# EAGLE design schematic (EAGLE 8.1.0)
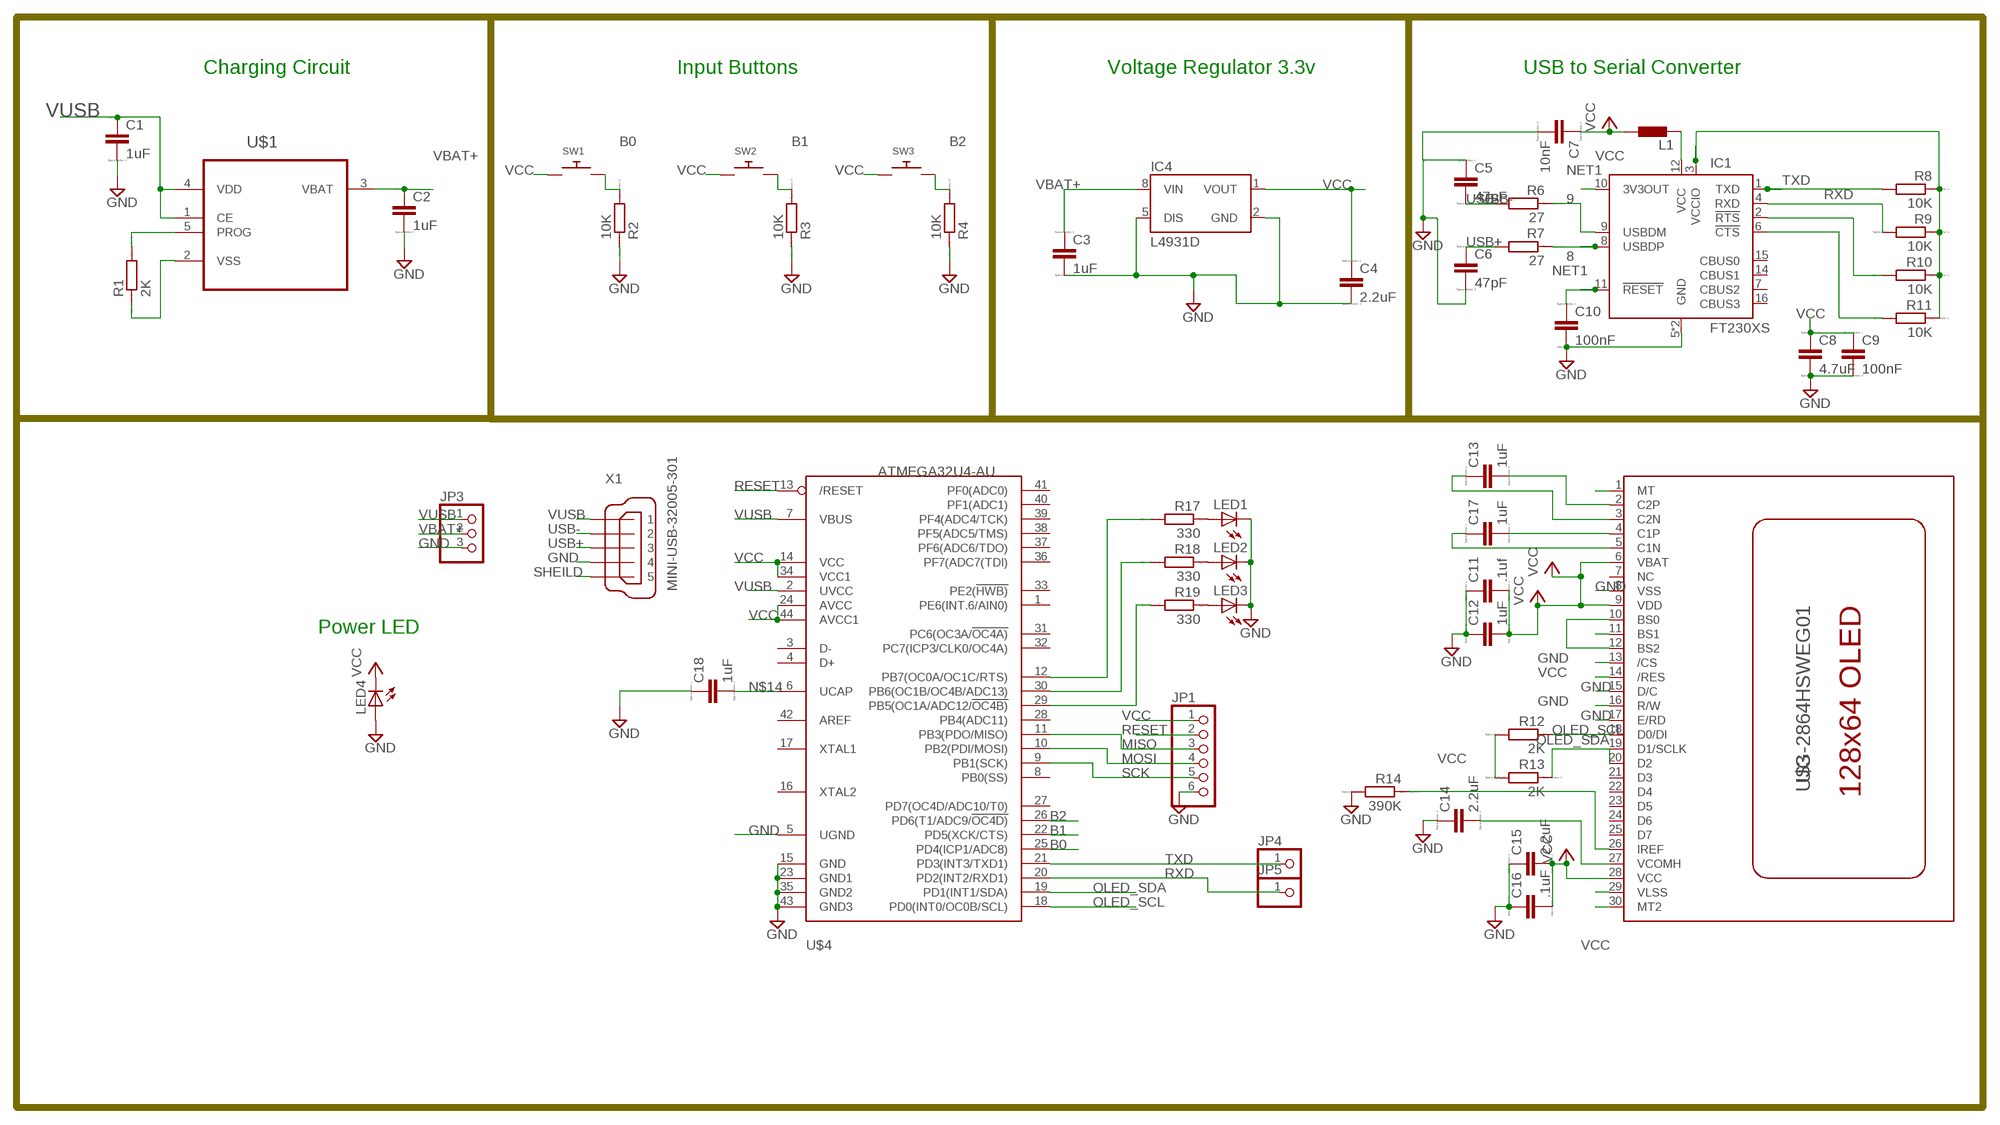
[diagram p0: schematic, sheet 1]

## Parts
C1  1uF  CC0504  [C0504]
C2  1uF  CC0504  [C0504]
C3  1uF  CC0504  [C0504]
C4  2.2uF  CC0504  [C0504]
C5  47pF  CC0504  [C0504]
C6  47pF  CC0504  [C0504]
C7  10nF  CC0504  [C0504]
C8  4.7uF  CC0504  [C0504]
C9  100nF  CC0504  [C0504]
C10  100nF  CC0504  [C0504]
C11  .1uf  CC0504  [C0504]
C12  1uF  CC0504  [C0504]
C13  1uF  CC0504  [C0504]
C14  2.2uF  CC0504  [C0504]
C15  2.2uF  CC0504  [C0504]
C16  .1uF  CC0504  [C0504]
C17  1uF  CC0504  [C0504]
C18  1uF  CC0504  [C0504]
IC1  FT230XS  [SSOP16]
IC4  L4931D  [SO08]
JP1  PINHD-1X6B  [1X06-BIG]
JP3  PINHD-1X3  [1X03]
JP4  PINHD-1X1  [1X01]
JP5  PINHD-1X1  [1X01]
L1  BLM15HB221SN1  [0402]
LED1  LEDSMT1206  [1206]
LED2  LEDSMT1206  [1206]
LED3  LEDSMT1206  [1206]
LED4  LEDSMT1206  [1206]
R1  2K  RR0603  [R0603]
R2  10K  RR0603  [R0603]
R3  10K  RR0603  [R0603]
R4  10K  RR0603  [R0603]
R6  27  RR0603  [R0603]
R7  27  RR0603  [R0603]
R8  10K  RR0603  [R0603]
R9  10K  RR0603  [R0603]
R10  10K  RR0603  [R0603]
R11  10K  RR0603  [R0603]
R12  2K  RR0603  [R0603]
R13  2K  RR0603  [R0603]
R14  390K  RR0603  [R0603]
R17  330  RR0603  [R0603]
R18  330  RR0603  [R0603]
R19  330  RR0603  [R0603]
SW1  SWITCH_PUSHBUTTONSOFTTOUCHSMD_SJ  [PUSHBUTTON_SMD_SJ]
SW2  SWITCH_PUSHBUTTONSOFTTOUCHSMD_SJ  [PUSHBUTTON_SMD_SJ]
SW3  SWITCH_PUSHBUTTONSOFTTOUCHSMD_SJ  [PUSHBUTTON_SMD_SJ]
U$1  MCP73812T-420I/OT  [SOT95P270X145-5N]
U$3  UG-2864HSWEG01  [1X30-0.7MM]
U$4  ATMEGA32U4-AU  [TQFP44]
X1  MINI-USB-32005-301  [32005-301]

## Nets
8: IC1.8(USBDP) R7.1
9: IC1.9(USBDM) R6.1
B0: R2.2 SW1.P$2 U$4.25(PD4(ICP1/ADC8))
B1: R3.2 SW2.P$2 U$4.22(PD5(XCK/CTS))
B2: R4.2 SW3.P$2 U$4.26(PD6(T1/ADC9/!OC4D))
FTDI_VCC: IC1.12(VCC) L1.1
GND: C1.2 C2.2 C3.2 C4.2 C5.1 C6.2 C7.2 C8.2 C9.2 C10.2 C11.1 C12.1 C14.1 C15.1 C16.1 C18.1 IC1.5(GND) IC1.13(GND) IC4.2(GND) IC4.5(DIS) JP1.6 JP3.3 LED1.C LED2.C LED3.C LED4.A R2.1 R3.1 R4.1 R14.2 U$3.1(MT) U$3.8(VSS) U$3.10(BS0) U$3.12(BS2) U$3.13(/CS) U$3.15(D/C) U$3.16(R/W) U$3.17(E/RD) U$3.29(VLSS) U$3.30(MT2) U$4.5(UGND) U$4.15(GND) U$4.23(GND1) U$4.35(GND2) U$4.43(GND3) X1.4
MISO: JP1.3 U$4.11(PB3(PDO/MISO))
MOSI: JP1.4 U$4.10(PB2(PDI/MOSI))
N$1: R1.2 U$1.5(PROG)
N$2: R1.1 U$1.2(VSS)
N$5: C14.2 U$3.27(VCOMH)
N$6: IC1.2(!RTS) R10.2
N$7: C13.2 U$3.2(C2P)
N$8: IC1.6(!CTS) R11.2
N$9: R14.1 U$3.26(IREF)
N$10: C13.1 U$3.3(C2N)
N$11: C17.2 U$3.4(C1P)
N$12: C17.1 U$3.5(C1N)
N$14: C18.2 U$4.6(UCAP)
N$17: LED1.A R17.1
N$18: LED2.A R18.1
N$19: LED3.A R19.1
N$21: R19.2 U$4.29(PB5(OC1A/ADC12/!OC4B))
N$22: R18.2 U$4.30(PB6(OC1B/OC4B/ADC13))
N$23: R17.2 U$4.12(PB7(OC0A/OC1C/RTS))
NET1: C10.1 IC1.3(VCCIO) IC1.10(3V3OUT) IC1.11(!RESET) R8.1 R9.1 R10.1 R11.1
OLED_SCL: R12.1 U$3.18(D0/DI) U$4.18(PD0(INT0/OC0B/SCL))
OLED_SDA: R13.1 U$3.19(D1/SCLK) U$3.20(D2) U$4.19(PD1(INT1/SDA))
RESET: JP1.2 U$4.13(/RESET)
RXD: IC1.4(RXD) JP5.1 R9.2 U$4.20(PD2(INT2/RXD1))
SCK: JP1.5 U$4.9(PB1(SCK))
SHEILD: X1.5
TXD: IC1.1(TXD) JP4.1 R8.2 U$4.21(PD3(INT3/TXD1))
USB+: C6.1 R7.2 X1.3
USB-: C5.2 R6.2 X1.2
VBAT+: C2.1 C3.1 IC4.8(VIN) JP3.2 U$1.3(VBAT)
VCC: C4.1 C7.1 C8.1 C9.1 C11.2 C12.2 C15.2 C16.2 IC4.1(VOUT) JP1.1 L1.2 LED4.C R12.2 R13.2 SW1.P$1 SW2.P$1 SW3.P$1 U$3.6(VBAT) U$3.9(VDD) U$3.11(BS1) U$3.14(/RES) U$3.28(VCC) U$4.14(VCC) U$4.24(AVCC) U$4.34(VCC1) U$4.44(AVCC1)
VUSB: C1.1 JP3.1 U$1.1(CE) U$1.4(VDD) U$4.2(UVCC) U$4.7(VBUS) X1.1
Unconnected: IC1.7(CBUS2) IC1.14(CBUS1) IC1.15(CBUS0) IC1.16(CBUS3) U$3.7(NC) U$3.21(D3) U$3.22(D4) U$3.23(D5) U$3.24(D6) U$3.25(D7) U$4.1(PE6(INT.6/AIN0)) U$4.3(D-) U$4.4(D+) U$4.8(PB0(SS)) U$4.16(XTAL2) U$4.17(XTAL1) U$4.27(PD7(OC4D/ADC10/T0)) U$4.28(PB4(ADC11)) U$4.31(PC6(OC3A/!OC4A)) U$4.32(PC7(ICP3/CLK0/OC4A)) U$4.33(PE2(!HWB)) U$4.36(PF7(ADC7(TDI)) U$4.37(PF6(ADC6/TDO)) U$4.38(PF5(ADC5/TMS)) U$4.39(PF4(ADC4/TCK)) U$4.40(PF1(ADC1)) U$4.41(PF0(ADC0)) U$4.42(AREF)

## Notes on the sheet
- Charging Circuit | Input Buttons | Voltage Regulator 3.3v | USB to Serial Converter
- Power LED

## Library data of the parts
C1-C18 = eagle-ltspice:C: CAPACITOR, European symbol; SPICEMODEL: NONE; SPICEPREFIX: C
IC1 = ft230x_10:FT230X: USB to Basic UART IC Source: http://www.ftdichip.com/Support/Documents/DataSheets/ICs/DS_FT230X.pdf; MF: FTDI; MPN: FT230XS; OC_FARNELL: 2081321; OC_NEWARK: 83T7087
IC4 = v-reg-3:L4931: STMicroelectronics <http://www.st.com> 250mA low dropout voltage regulator Vin 5V to 28V (transients 40V), disable pin, 50µA shutdown current
JP1 = adafruit:PINHD-1X6: PIN HEADER
JP3 = adafruit:PINHD-1X3: PIN HEADER
JP4 JP5 = adafruit:PINHD-1X1: Pin header 1x1 for 0.1" spacing With round pins
L1 = inductors:BLM15H: EMIFIL (R) Chip Ferrite Bead for GHz Noise Source: http://www.murata.com/ Ferrite Bead BLM15H.pdf
LED1-LED4 = adafruit:LED: LED OSRAM: - CHIPLED LG R971, LG N971, LY N971, LG Q971, LY Q971, LO R971, LY R971 LH N974, LH R974 LS Q976, LO Q976, LY Q976 LO Q996 - Hyper CHIPLED LW Q18S LB Q993, LB Q99A, LB R99A - SideLED LS A670, LO A670, LY A670, LG A670, LP A670 LB A673, LV A673, LT A673, LW A673 LH A674 LY A675 LS A676, LA A676, LO A676, LY A676, LW A676 LS A679, LY A679, LG A679 - Hyper Micro SIDELED® LS Y876, LA Y876, LO Y876, LY Y876 LT Y87S - SmartLED LW L88C, LW L88S LB L89C, LB L89S, LG L890 LS L89K, LO L89K, LY L89K LS L896, LA L896, LO L896, LY L896 - TOPLED LS T670, LO T670, LY T670, LG T670, LP T670 LSG T670, LSP T670, LSY T670, LOP T670, LYG T670 LG T671, LOG T671, LSG T671 LB T673, LV T673, LT T673, LW T673 LH T674 LS T676, LA T676, LO T676, LY T676, LB T676, LH T676, LSB T676, LW T676 LB T67C, LV T67C, LT T67C, LS T67K, LO T67K, LY T67K, LW E67C LS E67B, LA E67B, LO E67B, LY E67B, LB E67C, LV E67C, LT E67C LW T67C LS T679, LY T679, LG T679 LS T770, LO T770, LY T770, LG T770, LP T770 LB T773, LV T773, LT T773, LW T773 LH T774 LS E675, LA E675, LY E675, LS T675 LS T776, LA T776, LO T776, LY T776, LB T776 LHGB T686 LT T68C, LB T68C - Hyper Mini TOPLED® LB M676 - Mini TOPLED Santana® LG M470 LS M47K, LO M47K, LY M47K Source: http://www.osram.convergy.de/
R1-R4 R7-R14 R17-R19 = eagle-ltspice:R: RESISTOR, European symbol; SPICEMODEL: NONE; SPICEPREFIX: R
R6 = eagle-ltspice:R: RESISTOR, European symbol; SPICEMODEL: NONE; SPICEPREFIX: R6
SW1-SW3 = adafruit:SWITCH_PUSHBUTTON: Buttons SOFTTOUCHSMD_SJ - Soft touch temporary push button (Super Junk Akihabara) Compatible with SKPMANE010 [Mouser: 688-SKPMAN] C&K_KSS = Digikey: KSS221GLFS
U$1 = Microchip_By_element14_Batch_1:MCP73812T-420I/OT: Charge Management Controller; MPN: MCP73812T-420I/OT; OC_FARNELL: 1627187; OC_NEWARK: 27M0232; PACKAGE: SOT-5; SUPPLIER: Microchip
U$3 = adafruit:UG-2864HSWEG01: UG-2864HSWEG01 OLED display
U$4 = adafruit:ATMEGA32U4: http://www.ladyada.net/library/eagle
X1 = con-cypressindustries:MINI-USB-: MINI USB-B Conector Source: www.cypressindustries.com; OC_FARNELL: unknown; OC_NEWARK: unknown

## Module USBTOSERIAL
Ports: 

### Library data of the parts

## Board
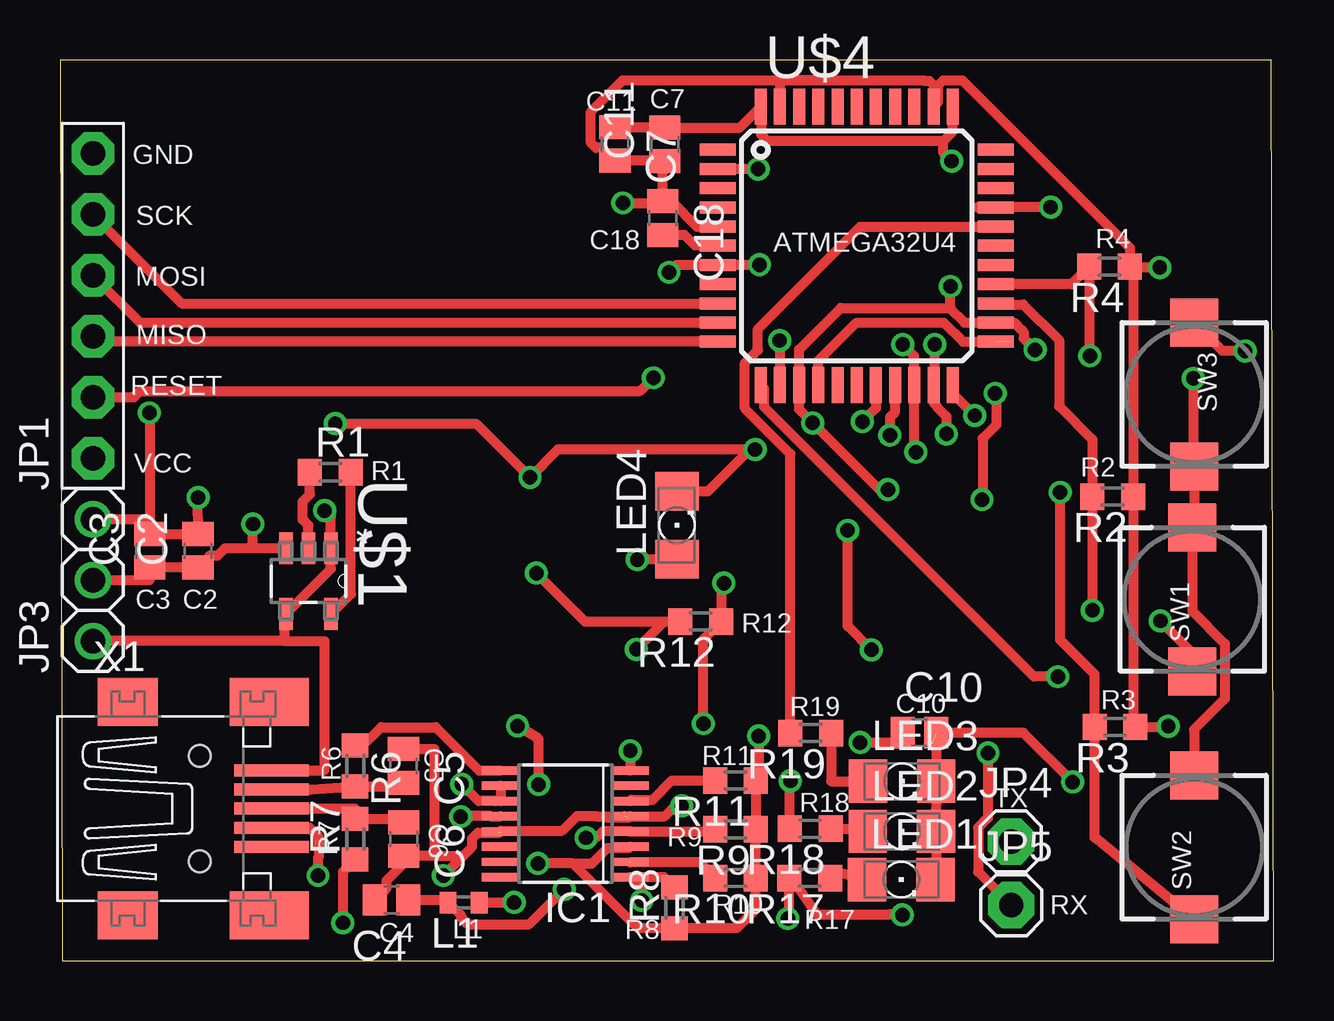
[diagram p1: board, top side]
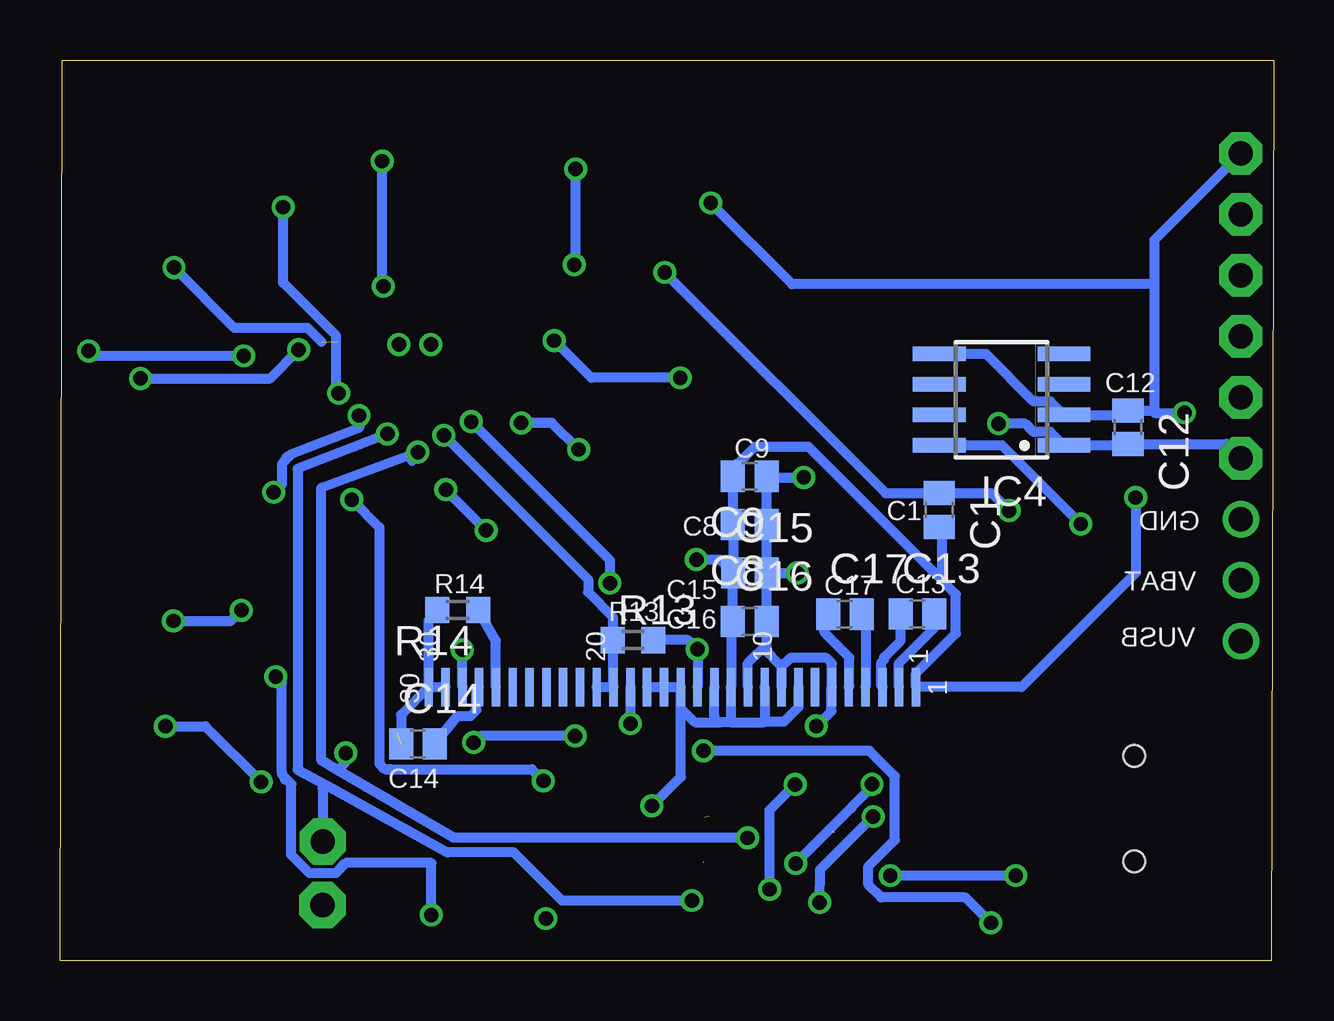
[diagram p2: board, bottom side, seen from below]

Size 50.57 x 37.56 mm. Coordinates in mm from the lower left corner, seen from the top.
Outline: 0.1,0 50.57,0 50.47,37.56 0,37.56 0.1,0
Copper layers (1*16): Top 0.0356mm / dielectric 1.5011mm / Bottom 0.0356mm
Design rules "oshpark-2layer": minimum track width 6mil, minimum drill 13mil, track to track 6mil, track to pad 6mil, pad to pad 6mil, via to via 6mil, smd to smd 6mil, copper to edge 15mil, drill to drill 6mil, minimum pad ring 7mil, minimum via ring 7mil, stop-mask expansion 2.5mil, vias tented up to drill 0mil, thermal gap 10mil

### Footprints (pad centres in the part's own frame; a part is rotated, then mirrored left to right if it is on the bottom)
C0504 = smd 1 x 1.3: 1 -0.7,0; 2 0.7,0
SSOP16 = smd 0.35 x 1.55: 1 -2.223,-2.7; 2 -1.587,-2.7; 3 -0.953,-2.7; 4 -0.318,-2.7; 5 0.318,-2.7; 6 0.953,-2.7; 7 1.587,-2.7; 8 2.223,-2.7; 9 2.223,2.7; 10 1.587,2.7; 11 0.953,2.7; 12 0.318,2.7; 13 -0.318,2.7; 14 -0.953,2.7; 15 -1.587,2.7; 16 -2.223,2.7
SO08 = smd 0.6 x 2.2: 1 -1.905,-2.6; 2 -0.635,-2.6; 3 0.635,-2.6; 4 1.905,-2.6; 5 1.905,2.6; 6 0.635,2.6; 7 -0.635,2.6; 8 -1.905,2.6
1X06-BIG = drill 1.016 pad 1.778 octagon: 1 -6.35,0; 2 -3.81,0; 3 -1.27,0; 4 1.27,0; 5 3.81,0; 6 6.35,0
1X03 = drill 1.016: 1 -2.54,0; 2 0,0; 3 2.54,0
1X01 = drill 1.016 pad 1.93 octagon: 1 0,0
0402 = smd 0.7 x 0.9: 1 -0.65,0; 2 0.65,0
1206 = smd 1.6 x 1.803: A -1.422,0; C 1.422,0
R0603 = smd 1 x 1.1: 1 -0.85,0; 2 0.85,0
PUSHBUTTON_SMD_SJ = smd 2 x 2: P$1 3,0; P$2 -3,0
SOT95P270X145-5N = smd 1.321 x 0.559: 1 -1.372,0.94; 2 -1.372,0; 3 -1.372,-0.94; 4 1.372,-0.94; 5 1.372,0.94
1X30-0.7MM = smd 0.35 x 1.6: 1 -10.15,0; 2 -9.45,0; 3 -8.75,0; 4 -8.05,0; 5 -7.35,0; 6 -6.65,0; 7 -5.95,0; 8 -5.25,0; 9 -4.55,0; 10 -3.85,0; 11 -3.15,0; 12 -2.45,0; 13 -1.75,0; 14 -1.05,0; 15 -0.35,0; 16 0.35,0; 17 1.05,0; 18 1.75,0; 19 2.45,0; 20 3.15,0; 21 3.85,0; 22 4.55,0; 23 5.25,0; 24 5.95,0; 25 6.65,0; 26 7.35,0; 27 8.05,0; 28 8.75,0; 29 9.45,0; 30 10.15,0
TQFP44 = smd 1.5 x 0.5: 1 -5.8,4; 2 -5.8,3.2; 3 -5.8,2.4; 4 -5.8,1.6; 5 -5.8,0.8; 6 -5.8,0; 7 -5.8,-0.8; 8 -5.8,-1.6; 9 -5.8,-2.4; 10 -5.8,-3.2; 11 -5.8,-4; 23 5.8,-4; 24 5.8,-3.2; 25 5.8,-2.4; 26 5.8,-1.6; 27 5.8,-0.8; 28 5.8,0; 29 5.8,0.8; 30 5.8,1.6; 31 5.8,2.4; 32 5.8,3.2; 33 5.8,4 | smd 0.5 x 1.5: 12 -4,-5.8; 13 -3.2,-5.8; 14 -2.4,-5.8; 15 -1.6,-5.8; 16 -0.8,-5.8; 17 0,-5.8; 18 0.8,-5.8; 19 1.6,-5.8; 20 2.4,-5.8; 21 3.2,-5.8; 22 4,-5.8; 34 4,5.8; 35 3.2,5.8; 36 2.4,5.8; 37 1.6,5.8; 38 0.8,5.8; 39 0,5.8; 40 -0.8,5.8; 41 -1.6,5.8; 42 -2.4,5.8; 43 -3.2,5.8; 44 -4,5.8
32005-301 = smd 3.1 x 0.5: 1 3,1.6; 2 3,0.8; 3 3,0; 4 3,-0.8; 5 3,-1.6 | smd 2.5 x 2: M1 -3,-4.45; M2 -3,4.45 | smd 3.3 x 2: M3 2.9,4.45; M4 2.9,-4.45 | hole 0.9: 0,2.2; 0,-2.2

### Placement (x,y rotation side)
C1  13.93,18.8 270 bottom
C2  5.75,17.09 90 top
C3  3.73,17.09 90 top
C4  13.82,2.54 180 top
C5  14.31,8.13 270 top
C6  14.33,5.08 270 top
C7  23.13,34.05 270 top
C8  21.83,18.19 180 bottom
C9  21.83,20.21 180 bottom
C10  35.81,9.51 0 top
C11  25.2,34.04 90 top
C12  6.07,22.25 270 bottom
C13  14.85,14.47 0 bottom
C14  35.66,9.04 0 bottom
C15  21.82,16.17 0 bottom
C16  21.83,14.15 0 bottom
C17  17.87,14.45 0 bottom
C18  25.12,30.96 270 top
IC1  21.06,5.71 90 top
IC4  11.34,23.39 90 bottom
JP1  1.37,27.3 90 top
JP3  1.37,15.88 90 top
JP4  39.62,4.98 0 top
JP5  39.64,2.32 0 top
L1  16.81,2.44 180 top
LED1  35.05,3.39 0 top
LED2  35.08,5.4 0 top
LED3  35.09,7.49 0 top
LED4  25.7,18.16 90 top
R1  11.26,20.37 0 top
R2  43.87,19.35 180 top
R3  43.95,9.75 180 top
R4  43.73,28.94 180 top
R6  12.29,8.13 270 top
R7  12.29,5.08 90 top
R8  25.6,2.21 90 top
R9  28.14,5.49 180 top
R10  28.14,3.45 180 top
R11  28.14,7.52 180 top
R12  26.7,14.15 180 top
R13  26.7,13.37 0 bottom
R14  34,14.63 180 bottom
R17  31.24,3.45 180 top
R18  31.25,5.51 180 top
R19  31.28,9.5 180 top
SW1  47.18,15.07 90 top
SW2  47.26,4.74 90 top
SW3  47.26,23.61 270 top
U$1  10.35,15.84 270 top
U$3  25.06,11.42 180 bottom
U$4  33.2,29.81 0 top
X1  5.82,6.35 0 top

### Tracks (layer width: path | path; a pad name or v marks a point on that pad's centre or on a via)
8  (via drill 0.6 pad 0.25)
  Top 0.406: R7.1 11.79,3.72 v11.79,1.59 | v23.76,8.76 IC1.8
  Bottom 0.406: v11.79,1.59 12.84,2.65 16.35,2.65 16.89,3.18 16.89,3.93 15.78,5.04 15.78,7.7 16.85,8.76 v23.76,8.76
9
  Top 0.406: IC1.9 17.45,7.94 15.66,9.73 13.38,9.73 12.62,8.98 R6.1
B0  (via drill 0.6)
  Top 0.406: v43.02,14.61 R2.2 43.02,21.74 41.63,23.13 41.63,25.88 40.14,27.37 39.04,27.37 U$4.25 | SW1.P$2 47.18,12.84 v45.85,14.17
  Bottom 0.406: v45.85,14.17 43.46,14.17 v43.02,14.61
B1  (via drill 0.6)
  Top 0.406: SW2.P$2 43.1,5.15 R3.2 43.1,11.95 41.67,13.39 v41.67,19.54 | U$4.22 37.2,23.65 v38.11,22.73
  Bottom 0.406: v38.11,22.73 38.11,22.22 40.92,21.13 41.01,21.04 41.13,20.99 41.18,20.87 41.28,20.77 41.33,20.66 41.33,19.87 v41.67,19.54
B2  (via drill 0.6)
  Top 0.406: U$4.26 42.14,28.21 R4.2 42.88,25.26 v42.91,25.22 | v49.38,25.43 48.44,25.43 SW3.P$2
  Bottom 0.406: v42.91,25.22 49.17,25.22 v49.38,25.43
FTDI_VCC  (via drill 0.6 pad 0.25)
  Top 0.406: L1.1 v18.92,2.44 | v16.69,6.02 17.12,6.02 17.16,6.06 17.9,6.06 17.93,6.03 IC1.12
  Bottom 0.406: v18.92,2.44 18.9,3.81 v16.69,6.02
GND  (via drill 0.6, 0.6 pad 0.25)  (4 unrouted)
  Top 0.406: C4.2 13.61,3.03 13.61,3.36 14.33,4.07 C6.2 15.6,4.38 | v10.75,3.56 10.75,4.31 10.77,4.33 10.77,5.17 10.39,5.55 X1.4 | 16.8,4.38 v15.98,3.56 | 16.8,4.38 17.18,4.75 17.18,5.11 17.41,5.34 18.3,5.34 | 15.6,4.38 16.8,4.38 | C5.1 15.6,8.83 15.6,4.38 | JP3.3 3.73,18.41 C3.2 | 22.81,5.98 23.7,5.98 IC1.5 25.2,6.03 25.63,6.46 v25.91,6.46 | C3.2 C2.2 5.74,19.3 v5.75,19.32 | LED1.C 36.51,3.72 LED2.C LED3.C C10.2 40.14,9.51 v42.19,7.46 | v3.72,22.85 3.73,22.84 C3.2 | IC1.13 18.38,5.42 20.93,5.42 21.54,6.04 22.3,6.04 22.3,6.03 23.53,6.03 | R4.1 44.72,28.8 R2.1 44.72,9.84 R3.1 46.15,9.75 v46.18,9.78 | v45.82,28.91 44.58,28.91 R4.1 | U$4.5 | U$4.5 26.54,30.61 25.49,31.66 C18.1 | C11.1 25.2,33.22 | U$4.15 | U$4.15 31.6,25.02 33.19,26.61 36.83,26.61 37.63,25.81 U$4.23 | v23.46,31.6 25.06,31.6 C18.1 | LED4.A 24.07,16.74 v24.05,16.73 | U$4.43 30,36.66 30.04,36.71 31.67,36.71 | 31.67,36.71 35.99,36.71 36.02,36.69 36.22,36.69 36.4,36.51 U$4.35 36.59,35.8 36.59,36.5 36.8,36.71 37.59,36.71 44.58,29.73 R4.1 | C18.1 25.12,33.26 C11.1 | C11.1 25.18,33.35 C7.2 22.58,33.89 22.33,33.89 22.12,34.1 22.12,35.4 23.44,36.71 31.67,36.71
  Bottom 0.406: v10.75,3.56 v15.98,3.56 | IC4.2 9.3,23.32 10.01,23.32 11.99,25.3 IC4.5 | IC4.2 8.65,22.85 | 4.97,22.85 v3.72,22.85 | 4.97,22.85 4.97,28.21 | 4.97,28.21 4.97,30.06 JP1.6 | IC4.2 6.26,22.76 C12.1 5.07,22.95 4.97,22.85 | U$3.30 35.21,14.17 R14.2 | C15.1 22.51,16.12 C8.2 C9.2 22.38,20.14 22.38,20.73 22.31,20.73 21.62,21.43 19.38,21.43 13.83,15.88 | C15.1 22.53,16.12 C16.1 22.61,14.15 U$3.12 22.63,11.39 22.63,9.94 | U$3.10 21.21,9.97 | 23.04,9.94 arc90 23.31,10.21 U$3.13 | 23.04,9.94 24.12,9.94 24.7,10.53 | 24.7,10.53 U$3.15 U$3.16 U$3.17 | U$3.8 19.81,10.57 20.41,9.97 21.21,9.97 | v5.75,19.32 v5.74,19.32 5.74,16.18 10.5,11.42 U$3.1 | v25.91,6.46 24.7,7.67 24.7,10.53 | U$3.1 14.88,11.44 | 21.21,9.97 21.23,9.94 22.63,9.94 | 22.63,9.94 23.04,9.94 | U$3.1 14.91,11.98 13.24,13.65 13.24,15.28 13.83,15.88 | 39.67,25.81 40.25,26.39 43.3,26.39 v45.82,28.91 | v46.18,9.78 44.51,9.78 v42.19,7.46 | C1.2 13.83,18 13.83,15.88 | U$3.30 36.36,10.26 C14.1 | U$3.30 U$3.29 | 4.97,28.21 20.07,28.21 v23.46,31.6 | v24.05,16.73 23.08,16.73 C15.1
MISO
  Top 0.406: U$4.11 1.6,25.81 arc-90 JP1.3
MOSI
  Top 0.406: JP1.4 3.34,26.61 U$4.10
N$1
  Top 0.406: U$1.5 12.11,15.29 R1.2
N$2
  Top 0.406: R1.1 10.41,19.45 10.11,19.15 10.11,18.39 10.35,18.16 U$1.2
N$5
  Bottom 0.406: C14.2 33.99,10.21 33.46,10.21 33.23,10.45 33.23,11.26 U$3.27
N$6  (1 unrouted)
  Top 0.406: R10.2 26.65,4.1 23.76,4.1
N$7
  Bottom 0.406: U$3.2 15.62,12.41 14.15,13.88 C13.2
N$8
  Top 0.406: IC1.6 23.81,6.72 24.7,6.72 25.5,7.52 R11.2
N$9
  Bottom 0.406: U$3.26 32.41,13.34 R14.1
N$10
  Bottom 0.406: U$3.3 16.34,11.46 16.34,12.45 16.23,12.56 16.23,12.66 15.55,13.35 C13.1
N$11
  Bottom 0.406: C17.2 17.01,14.11 U$3.4
N$12
  Bottom 0.406: U$3.5 17.68,11.45 17.68,12.65 18.72,13.69 C17.1
N$14
  Top 0.406: U$4.6 26.47,29.82 26.02,30.26 C18.2
N$17
  Top 0.406: LED1.A 32.32,3.68 R17.1
N$18
  Top 0.406: R18.1 33.59,5.51 LED2.A
N$19
  Top 0.406: R19.1 32.13,7.49 LED3.A
N$21
  Top 0.406: R19.2 30.43,21.14 28.54,23.03 28.54,24.93 29.07,25.46 29.07,26.34 33.34,30.61 U$4.29
N$22  (via drill 0.6, 0.6 pad 0.25)
  Top 0.406: R18.2 30.4,7.48 v30.43,7.51 | 38.22,31.41 U$4.30 v41.27,31.42 | v38.96,23.66 39.02,23.66 39.02,22.36 38.44,21.78 38.44,19.23 v38.42,19.23
  Bottom 0.406: v30.43,7.51 30.91,7.99 36.8,7.99 | 36.8,7.99 37.03,7.99 | v41.27,31.42 41.27,28.27 39.06,26.06 39.06,23.76 v38.96,23.66 | 37.03,7.99 37.27,8.22 37.27,18.08 v38.42,19.23 | 37.03,7.99 36.8,7.99
N$23  (via drill 0.6, 0.6 pad 0.25)
  Top 0.406: v30.33,1.76 30.39,1.83 R17.2 30.47,3.45 31.52,1.94 34.59,1.94 35.04,1.96 v35.1,1.92 | U$4.12 29.34,23.86 29.34,23.09 40.58,11.85 v41.58,11.85
  Bottom 0.406: 40.92,7.36 41.04,7.48 41.19,7.56 41.21,7.65 | 41.21,7.65 41.28,7.72 41.33,7.88 41.33,11.6 v41.58,11.85 | v35.1,1.92 35.1,4.08 38.66,4.08 39.08,3.66 40.17,3.66 40.94,4.43 40.94,7.38 41.21,7.65
NET1  (via drill 0.6 pad 0.25)
  Top 0.406: IC1.10 IC1.11 18.16,6.67 18.15,6.67 17.43,6.67 v16.74,7.37 | IC1.3 23.7,4.71 22.81,4.71 22.17,4.06 21.36,4.06 | 21.36,4.06 v19.91,4.06 | v29.11,9.37 29.11,7.63 R11.1 R9.1 R10.1 28.99,2.16 28.19,1.36 R8.1 24.07,1.36 21.36,4.06 | v33.34,9.1 34.7,9.1 C10.1
  Bottom 0.406: v19.91,4.06 17.6,6.38 17.6,6.39 16.74,7.25 v16.74,7.37 | 29.21,9.47 v29.11,9.37 33.06,9.37 v33.34,9.1
OLED_SCL  (via drill 0.6, 0.6 pad 0.25)
  Top 0.406: v26.81,9.89 26.81,13.41 R12.1 27.55,15.63 v27.66,15.75 | U$4.18 34,23.04 v33.44,22.48
  Bottom 0.406: U$3.18 v26.81,9.89 | v33.44,22.48 27.66,16.7 v27.66,15.75
OLED_SDA  (via drill 0.6)
  Top 0.406: U$4.19 34.77,23.98 34.77,22.86 34.58,22.67 v34.58,21.91
  Bottom 0.406: U$3.20 U$3.19 27.55,11.46 R13.1 27.55,14.35 28.57,15.37 28.57,15.9 v34.58,21.91
RESET  (via drill 0.6)
  Top 0.406: JP1.2 3.08,23.5 3.34,23.76 24.18,23.76 v24.73,24.31 | v29.98,25.86 29.98,24.02 U$4.13
  Bottom 0.406: v24.73,24.31 28.44,24.31 v29.98,25.86
RXD  (via drill 0.6)
  Top 0.406: v21.92,5.13 22.34,5.13 22.62,5.41 IC1.4 23.77,5.41 27.22,5.41 arc90 R9.2 | v35.66,21.21 35.6,21.27 U$4.20 35.59,24.02 35.59,25.22 v35.12,25.69 v35.12,25.7 | v38.67,8.67 38.67,5.96 38.25,5.55 38.25,3.71 JP5.1
  Bottom 0.406: 22.02,5.03 v21.92,5.13 34.17,5.13 38.99,7.95 | 35.9,20.86 v35.66,21.21 39.68,19.73 39.68,8.35 38.99,7.95 | 38.99,7.95 38.67,8.28 v38.67,8.67
SCK
  Top 0.406: JP1.5 5.08,27.41 U$4.9
TXD  (via drill 0.6)  (1 unrouted)
  Top 0.406: R8.2 25.17,3.49 IC1.1 | IC1.1 24.24,3 v24.24,2.52 | v36.93,21.97 36.93,22.7 36.54,23.09 36.54,23.12 36.42,23.24 36.42,23.98 U$4.21 36.45,24.06 v36.45,25.7
  Bottom 0.406: v24.24,2.52 29.65,2.52 31.66,4.52 34.43,4.52 39.51,7.33 | 39.51,7.33 40.67,7.97 40.67,20.52 v36.93,21.97 | 39.51,7.33 39.62,7.21 JP4.1
USB+
  Top 0.406: X1.3 12.29,6.35 R7.2 14.33,5.93 C6.1
USB-
  Top 0.406: X1.2 10.47,7.15 R6.2 14.2,7.28 C5.2
VBAT+  (via drill 0.6 pad 0.25)
  Top 0.406: JP3.2 3.73,15.88 C3.1 C2.1 6.23,16.89 6.56,16.89 6.88,17.21 8.01,17.21 | 8.01,17.21 U$1.3 | 8.01,17.21 8.04,17.23 v8.04,18.21
  Bottom 0.406: v8.04,18.21 11.32,21.49 IC4.8
VCC  (via drill 0.6, 0.6 pad 0.25)
  Top 0.406: C4.1 16.22,2.54 L1.2 16.71,1.9 16.71,1.82 17,1.53 19.55,1.53 v21.01,2.98 | v19.94,7.35 19.94,9.25 v19.06,9.79 | 39.71,26.61 U$4.24 37.69,26.61 37.08,27.22 | 39.71,26.61 | 39.71,26.61 39.78,26.61 40.08,26.3 40.15,26.23 40.15,25.95 v40.63,25.48 | U$4.34 37.2,34.57 36.8,34.18 | 25.6,34.7 C11.2 | 28.74,21.32 20.75,21.32 v19.58,20.16 17.34,22.4 v11.47,22.4 | 28.74,21.32 v28.96,21.32 | U$4.14 30.8,22.99 v31.36,22.43 34.14,19.65 v34.49,19.65 | U$4.14 | U$4.14 30.8,25.49 32.52,27.22 37.08,27.22 | 36.8,34.18 29.49,34.18 29.21,34.45 29.21,35.59 U$4.44 28.33,34.74 C11.2 | 37.08,27.22 37.1,27.23 v37.1,28.12 | v37.15,33.34 36.8,33.68 36.8,34.18 | 25.17,14.15 R12.2 | 25.17,14.15 v24.02,12.99 | v19.85,16.17 21.87,14.15 25.17,14.15 | v33.81,12.97 32.82,13.96 v32.82,17.95 | LED4.C 27,19.58 28.74,21.32 | C7.1 C11.2 | v47.22,24.28 47.22,20.65 SW3.P$1 47.26,18.15 SW1.P$1 47.18,14.58 48.54,13.22 48.54,10.93 47.26,9.65 SW2.P$1
  Bottom 0.406: 1.9,21.49 JP1.1 1.97,21.55 C12.2 6.13,21.49 IC4.1 9.3,22.05 10.01,22.05 10.36,22.4 v11.47,22.4 | C16.2 21.13,16.12 C15.2 | C15.2 21.12,18.15 C8.1 C9.1 21.09,20.16 v19.58,20.16 | U$3.11 21.91,12.42 21.13,13.2 C16.2 | 20.51,12.27 U$3.9 | 20.51,12.27 20.63,12.38 20.63,12.39 21.13,12.89 C16.2 | v21.01,2.98 21.01,6.29 v19.94,7.35 | v19.06,9.79 19.09,9.74 18.43,10.4 18.43,11.4 U$3.6 18.41,12.39 18.4,12.39 18.63,12.62 20.15,12.62 20.51,12.27 | v47.22,24.28 41.82,24.28 v40.63,25.48 | v28.96,21.32 30.07,22.43 v31.36,22.43 | v37.1,28.12 37.15,28.17 v37.15,33.34 | R13.2 24.4,13.37 v24.02,12.99 v24.01,12.98 U$3.14 | C15.2 v19.85,16.17 | U$3.28 v33.81,12.97 | v32.82,17.95 34.49,19.62 v34.49,19.65
VUSB  (via drill 0.6)
  Top 0.406: X1.1 11.02,7.95 11.02,13.34 9.35,13.34 | 9.35,13.34 JP3.1 | 9.35,13.34 9.35,14.46 U$1.4 11.29,16.34 U$1.1 11.29,18.5 v11.02,18.77 | v29.15,29.02 U$4.7 25.68,29.01 v25.37,28.7 | v29.09,33.01 U$4.2
  Bottom 0.406: v11.02,18.77 11.75,19.5 C1.1 16.17,19.5 v25.37,28.7 | v29.15,29.02 29.09,29.08 v29.09,33.01

### Text on the board
tSilk: C11 | C7 | GND | SCK | C18 | ATMEGA32U4 | R4 | MOSI | MISO | RESET | VCC | R1 | R2 | C3 | C2 | R12 | R19 | C10 | R3 | R6 | C5 | R11 | R7 | C6 | R18 | TX | R9 | R10 | RX | C4 | L1 | R8 | R17
bSilk: C12 | C9 | C1 | GND | C8 | VBAT | C13 | C17 | C16 | C15 | R14 | R13 | VUSB | 1 | 30 | C14